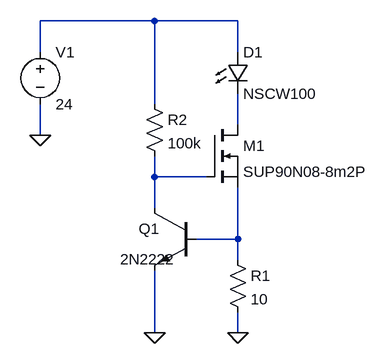
[diagram p0: schematic cc_led_driver.asc]
cc_led_driver.asc, the LTspice schematic file:
Version 4
SHEET 1 880 680
WIRE -592 128 -768 128
WIRE -464 128 -592 128
WIRE -768 176 -768 128
WIRE -464 176 -464 128
WIRE -592 256 -592 128
WIRE -464 288 -464 240
WIRE -768 304 -768 256
WIRE -592 368 -592 336
WIRE -512 368 -592 368
WIRE -592 416 -592 368
WIRE -464 464 -464 384
WIRE -464 464 -528 464
WIRE -464 496 -464 464
WIRE -592 608 -592 512
WIRE -464 608 -464 576
FLAG -464 608 0
FLAG -592 608 0
FLAG -768 304 0
SYMBOL nmos -512 288 R0
SYMATTR InstName M1
SYMATTR Value SUP90N08-8m2P
SYMBOL npn -528 416 M0
WINDOW 3 32 79 Left 2
SYMATTR InstName Q1
SYMATTR Value 2N2222
SYMBOL res -480 480 R0
SYMATTR InstName R1
SYMATTR Value 10
SYMATTR SpiceLine pwr=1
SYMBOL res -608 240 R0
SYMATTR InstName R2
SYMATTR Value 100k
SYMBOL voltage -768 160 R0
WINDOW 123 0 0 Left 2
WINDOW 39 0 0 Left 2
SYMATTR InstName V1
SYMATTR Value 24
SYMBOL LED -480 176 R0
SYMATTR InstName D1
SYMATTR Value NSCW100
SYMATTR Description Diode
SYMATTR Type diode

The netlist it stands for:
* cc_led_driver.asc
M1 N002 N003 N004 N004 SUP90N08-8m2P
Q1 N003 N004 0 0 2N2222
R1 N004 0 10 pwr=1
R2 N001 N003 100k
V1 N001 0 24
D1 N001 N002 NSCW100
.model D D
.lib standard.dio
.model NPN NPN
.model PNP PNP
.lib standard.bjt
.model NMOS NMOS
.model PMOS PMOS
.lib standard.mos
.backanno
.end